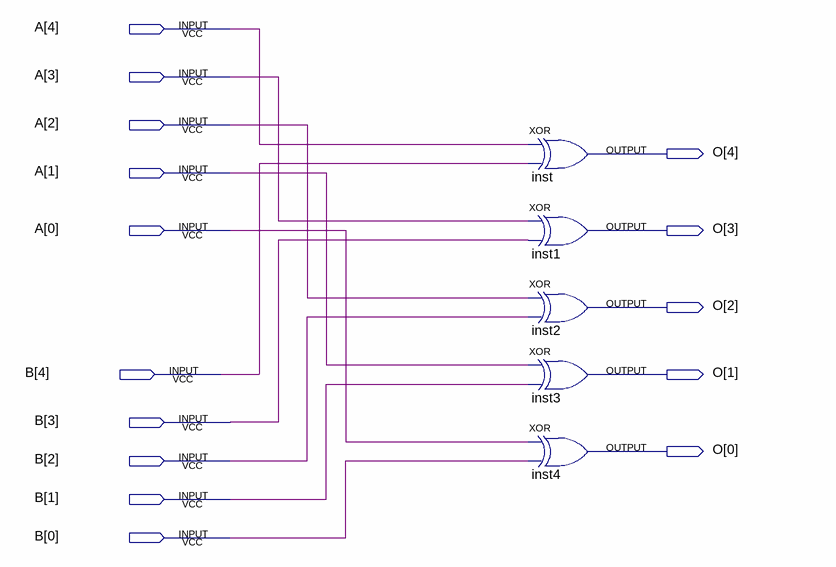
[diagram p0: schematic sheet]
// Quartus schematic XOR.bdf as structural Verilog: 5 symbols, 15 pins
module XOR (
  input  [4:0] A,
  input  [4:0] B,
  output [4:0] O
);

  xor inst (O[4], A[4], B[4]);
  xor inst1 (O[3], A[3], B[3]);
  xor inst2 (O[2], A[2], B[2]);
  xor inst3 (O[1], A[1], B[1]);
  xor inst4 (O[0], A[0], B[0]);
endmodule
